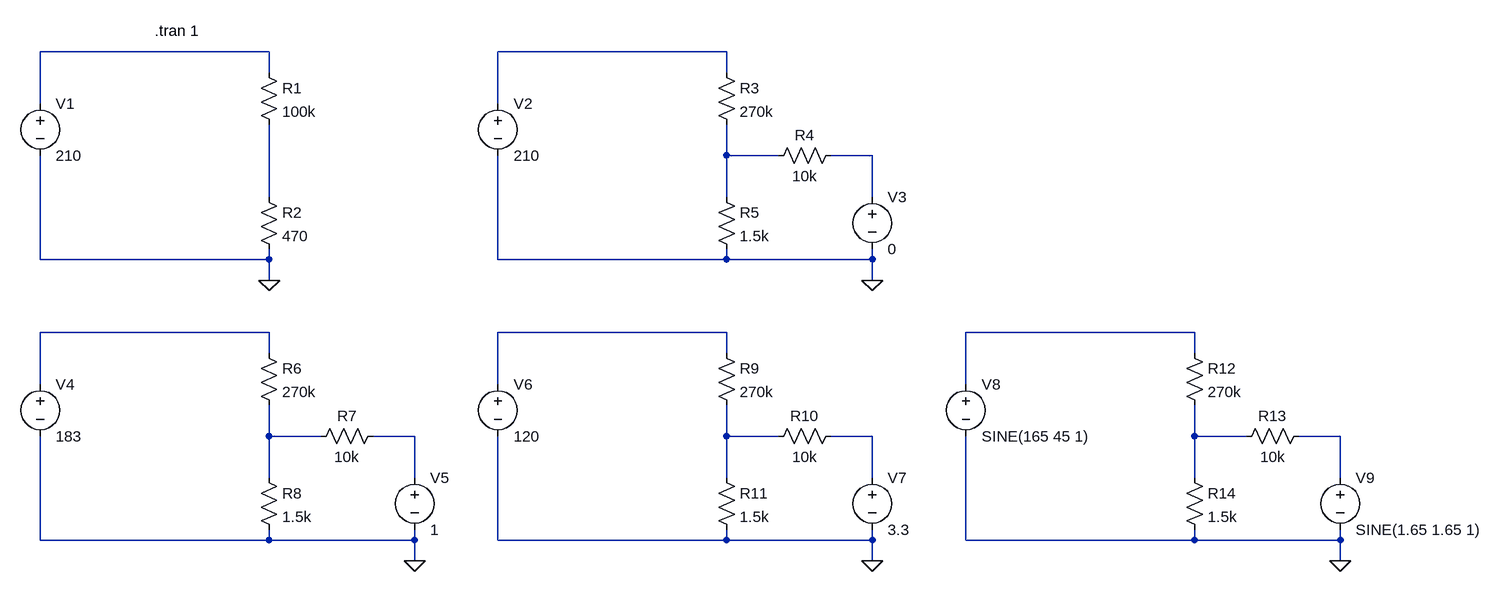
[diagram p0: schematic HV_control.asc]
HV_control.asc, the LTspice schematic file:
Version 4
SHEET 1 1628 868
WIRE -256 64 -608 64
WIRE 448 64 96 64
WIRE -256 96 -256 64
WIRE 448 96 448 64
WIRE -608 144 -608 64
WIRE 96 144 96 64
WIRE 448 224 448 176
WIRE 528 224 448 224
WIRE 672 224 608 224
WIRE -256 288 -256 176
WIRE 448 288 448 224
WIRE 672 288 672 224
WIRE -608 384 -608 224
WIRE -256 384 -256 368
WIRE -256 384 -608 384
WIRE 96 384 96 224
WIRE 448 384 448 368
WIRE 448 384 96 384
WIRE 672 384 672 368
WIRE 672 384 448 384
WIRE -256 416 -256 384
WIRE 672 416 672 384
WIRE -256 496 -608 496
WIRE 448 496 96 496
WIRE 1168 496 816 496
WIRE -256 528 -256 496
WIRE 448 528 448 496
WIRE 1168 528 1168 496
WIRE -608 576 -608 496
WIRE 96 576 96 496
WIRE 816 576 816 496
WIRE -256 656 -256 608
WIRE -176 656 -256 656
WIRE -32 656 -96 656
WIRE 448 656 448 608
WIRE 528 656 448 656
WIRE 672 656 608 656
WIRE 1168 656 1168 608
WIRE 1248 656 1168 656
WIRE 1392 656 1328 656
WIRE -256 720 -256 656
WIRE -32 720 -32 656
WIRE 448 720 448 656
WIRE 672 720 672 656
WIRE 1168 720 1168 656
WIRE 1392 720 1392 656
WIRE -608 816 -608 656
WIRE -256 816 -256 800
WIRE -256 816 -608 816
WIRE -32 816 -32 800
WIRE -32 816 -256 816
WIRE 96 816 96 656
WIRE 448 816 448 800
WIRE 448 816 96 816
WIRE 672 816 672 800
WIRE 672 816 448 816
WIRE 816 816 816 656
WIRE 1168 816 1168 800
WIRE 1168 816 816 816
WIRE 1392 816 1392 800
WIRE 1392 816 1168 816
WIRE -32 848 -32 816
WIRE 672 848 672 816
WIRE 1392 848 1392 816
FLAG 672 416 0
FLAG -256 416 0
FLAG -32 848 0
FLAG 672 848 0
FLAG 1392 848 0
SYMBOL res 432 80 R0
SYMATTR InstName R3
SYMATTR Value 270k
SYMBOL voltage 96 128 R0
WINDOW 123 0 0 Left 0
WINDOW 39 0 0 Left 0
SYMATTR InstName V2
SYMATTR Value 210
SYMBOL voltage 672 272 R0
WINDOW 123 0 0 Left 0
WINDOW 39 0 0 Left 0
SYMATTR InstName V3
SYMATTR Value 0
SYMBOL res 624 208 R90
WINDOW 0 0 56 VBottom 2
WINDOW 3 32 56 VTop 2
SYMATTR InstName R4
SYMATTR Value 10k
SYMBOL res 432 272 R0
SYMATTR InstName R5
SYMATTR Value 1.5k
SYMBOL res -272 80 R0
SYMATTR InstName R1
SYMATTR Value 100k
SYMBOL voltage -608 128 R0
WINDOW 123 0 0 Left 0
WINDOW 39 0 0 Left 0
SYMATTR InstName V1
SYMATTR Value 210
SYMBOL res -272 272 R0
SYMATTR InstName R2
SYMATTR Value 470
SYMBOL res -272 512 R0
SYMATTR InstName R6
SYMATTR Value 270k
SYMBOL voltage -608 560 R0
WINDOW 123 0 0 Left 0
WINDOW 39 0 0 Left 0
SYMATTR InstName V4
SYMATTR Value 183
SYMBOL voltage -32 704 R0
WINDOW 123 0 0 Left 0
WINDOW 39 0 0 Left 0
SYMATTR InstName V5
SYMATTR Value 1
SYMBOL res -80 640 R90
WINDOW 0 0 56 VBottom 2
WINDOW 3 32 56 VTop 2
SYMATTR InstName R7
SYMATTR Value 10k
SYMBOL res -272 704 R0
SYMATTR InstName R8
SYMATTR Value 1.5k
SYMBOL res 432 512 R0
SYMATTR InstName R9
SYMATTR Value 270k
SYMBOL voltage 96 560 R0
WINDOW 123 0 0 Left 0
WINDOW 39 0 0 Left 0
SYMATTR InstName V6
SYMATTR Value 120
SYMBOL voltage 672 704 R0
WINDOW 123 0 0 Left 0
WINDOW 39 0 0 Left 0
SYMATTR InstName V7
SYMATTR Value 3.3
SYMBOL res 624 640 R90
WINDOW 0 0 56 VBottom 2
WINDOW 3 32 56 VTop 2
SYMATTR InstName R10
SYMATTR Value 10k
SYMBOL res 432 704 R0
SYMATTR InstName R11
SYMATTR Value 1.5k
SYMBOL res 1152 512 R0
SYMATTR InstName R12
SYMATTR Value 270k
SYMBOL voltage 816 560 R0
WINDOW 123 0 0 Left 0
WINDOW 39 0 0 Left 0
SYMATTR InstName V8
SYMATTR Value SINE(165 45 1)
SYMBOL voltage 1392 704 R0
WINDOW 123 0 0 Left 0
WINDOW 39 0 0 Left 0
SYMATTR InstName V9
SYMATTR Value SINE(1.65 1.65 1)
SYMBOL res 1344 640 R90
WINDOW 0 0 56 VBottom 2
WINDOW 3 32 56 VTop 2
SYMATTR InstName R13
SYMATTR Value 10k
SYMBOL res 1152 704 R0
SYMATTR InstName R14
SYMATTR Value 1.5k
TEXT -432 32 Left 2 !.tran 1

The netlist it stands for:
* HV_control.asc
R3 N002 N003 270k
V2 N002 0 210
V3 N004 0 0
R4 N004 N003 10k
R5 N003 0 1.5k
R1 N001 N005 100k
V1 N001 0 210
R2 N005 0 470
R6 N006 N009 270k
V4 N006 0 183
V5 N010 0 1
R7 N010 N009 10k
R8 N009 0 1.5k
R9 N007 N011 270k
V6 N007 0 120
V7 N012 0 3.3
R10 N012 N011 10k
R11 N011 0 1.5k
R12 N008 N013 270k
V8 N008 0 SINE(165 45 1)
V9 N014 0 SINE(1.65 1.65 1)
R13 N014 N013 10k
R14 N013 0 1.5k
.tran 1
.backanno
.end